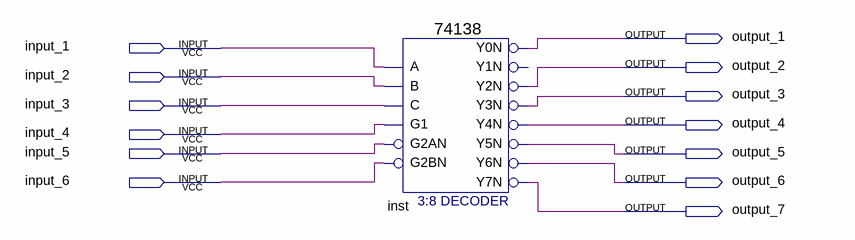
[diagram p0: schematic sheet]
// Quartus schematic Quartus.bdf as structural Verilog: 1 symbols, 13 pins
module Quartus (
  input  input_1,
  input  input_2,
  input  input_3,
  input  input_4,
  input  input_5,
  input  input_6,
  output output_1,
  output output_2,
  output output_3,
  output output_4,
  output output_5,
  output output_6,
  output output_7
);

  \74138  inst (
    .A(input_1), .B(input_2), .G1(input_4), .C(input_3), .G2AN(input_5), .G2BN(input_6), .Y0N(output_1),
    .Y2N(output_2), .Y3N(output_3), .Y4N(output_4), .Y5N(output_5), .Y6N(output_6), .Y7N(output_7));  // open: Y1N
endmodule
